# Altium schematic sheet Mainboard_RMII_Interface.SchDoc
size B
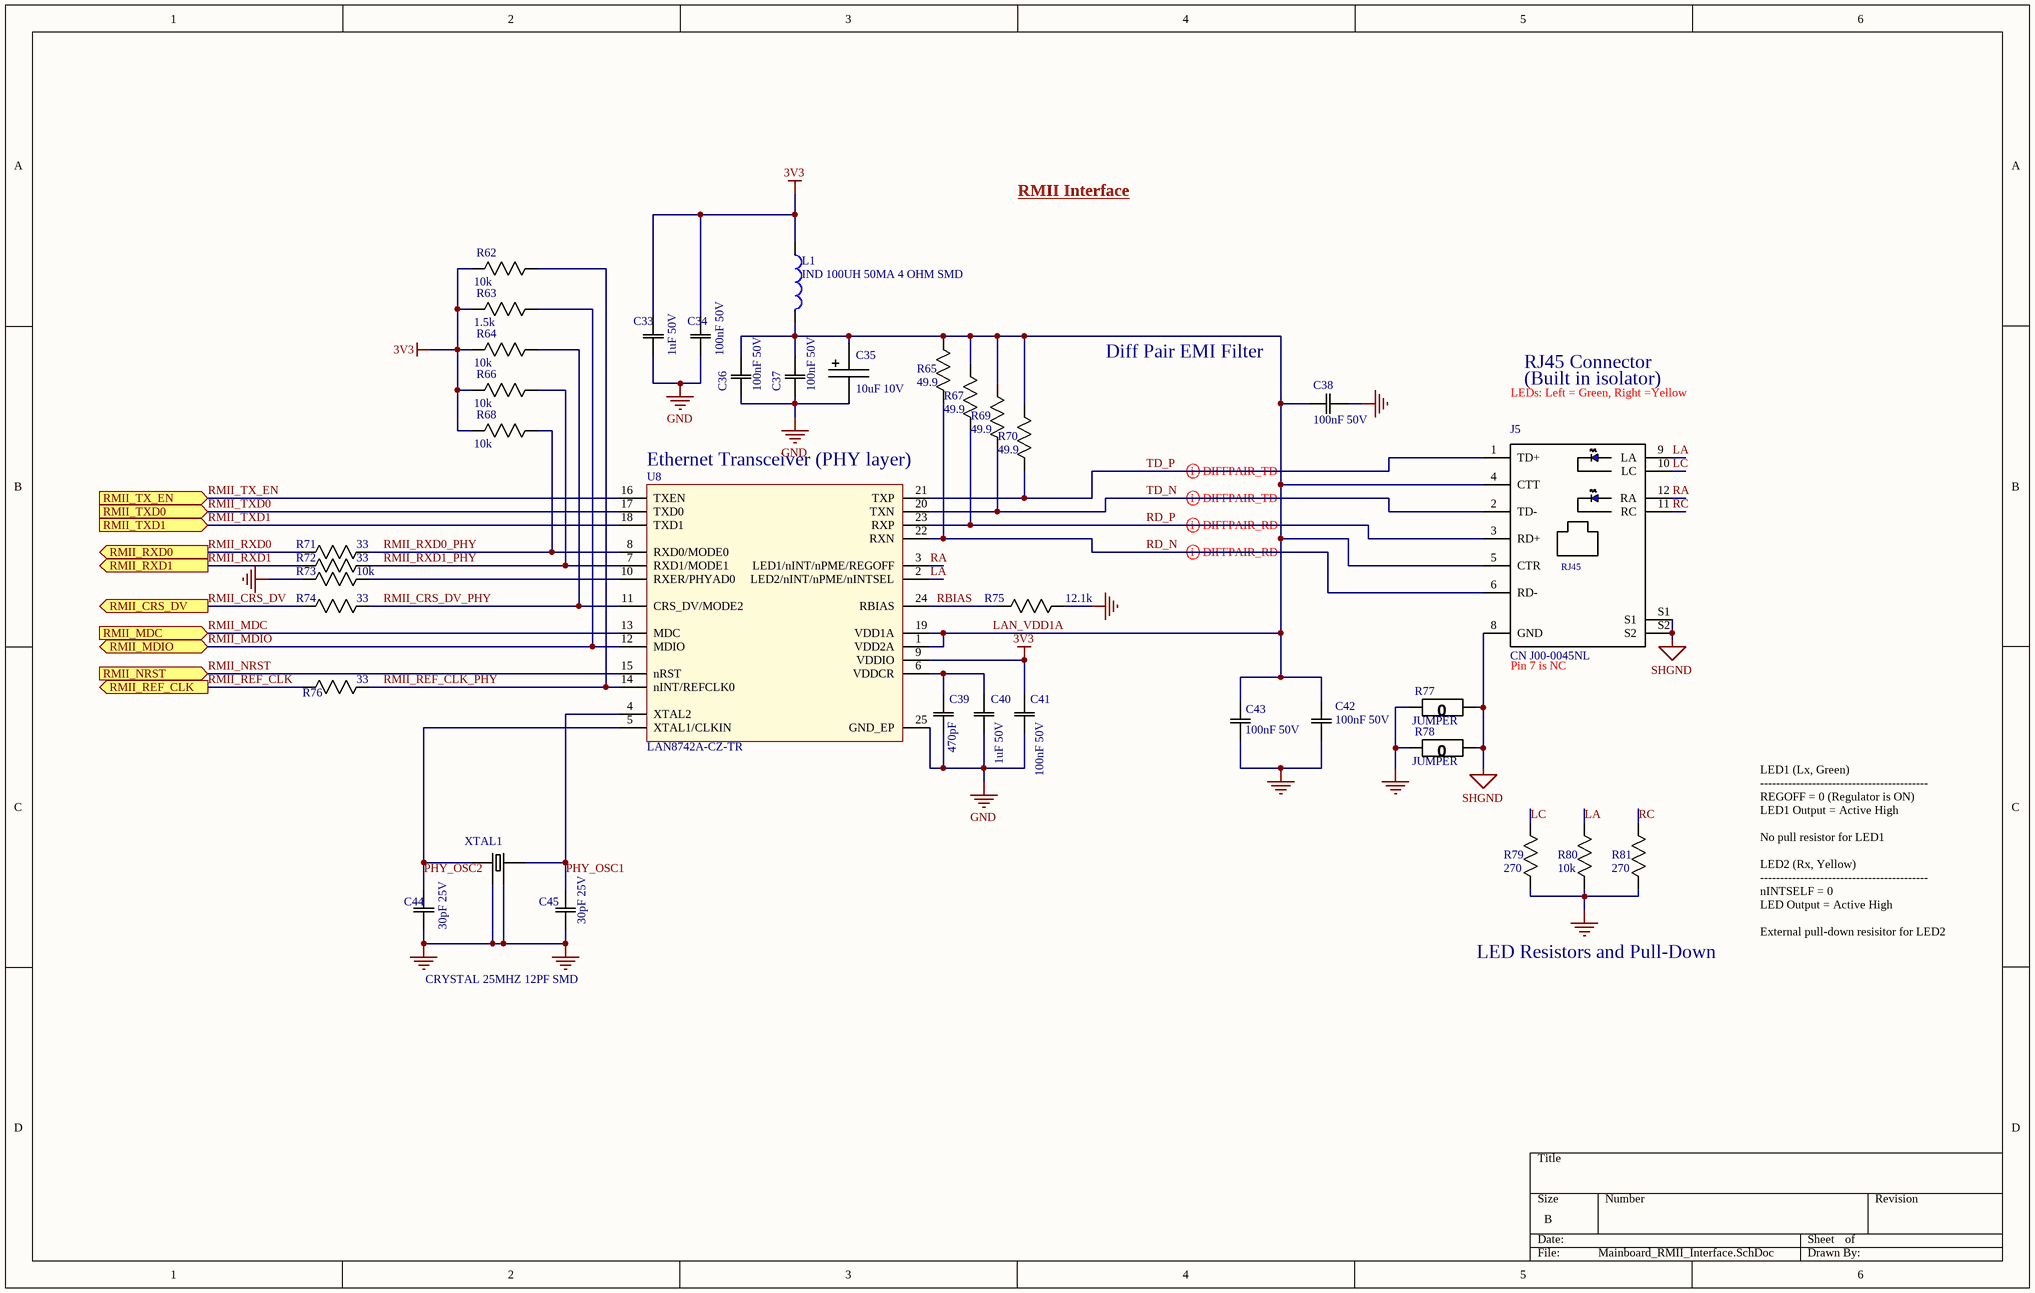
[diagram p0: Mainboard_RMII_Interface.SchDoc]

## Parts
C33  1uF 50V  [0603]
C34  100nF 50V  [0603]
C35  10uF 10V  [1206 Polarized]
C36  100nF 50V  [0603]
C37  100nF 50V  [0603]
C38  100nF 50V  [0603]
C39  470pF  [0603]
C40  1uF 50V  [0603]
C41  100nF 50V  [0603]
C42  100nF 50V  [0603]
C43  100nF 50V  [0603]
C44  30pF 25V  [0603]
C45  30pF 25V  [0603]
J5  CN J00-0045NL  [RJ45 J00-0045NL]
L1  IND 100UH 50MA 4 OHM SMD  [0805]
R62  10k  [0603]
R63  1.5k  [0603]
R64  10k  [0603]
R65  49.9  [0603]
R66  10k  [0603]
R67  49.9  [0603]
R68  10k  [0603]
R69  49.9  [0603]
R70  49.9  [0603]
R71  33  [0603]
R72  33  [0603]
R73  10k  [0603]
R74  33  [0603]
R75  12.1k  [0603]
R76  33  [0603]
R77  JUMPER  [0603]
R78  JUMPER  [0603]
R79  270  [0603]
R80  10k  [0603]
R81  270  [0603]
U8  LAN8742A-CZ-TR  [24-QFN (4x4)]
XTAL1  CRYSTAL 25MHZ 12PF SMD  [3225-4SMD]

## Ports
RMII_CRS_DV (out), RMII_MDC (in), RMII_MDIO (bidir), RMII_NRST (in), RMII_REF_CLK (out), RMII_RXD0 (out), RMII_RXD1 (out), RMII_TX_EN (in), RMII_TXD0 (in), RMII_TXD1 (in)

## Nets
3V3: C33.2(C2) C34.2(C2) C41.2(C2) L1.1 R62.2(R2) R63.2(R2) R64.2(R2) R66.2(R2) R68.2(R2) U8.9(VDDIO)
GND: C33.1(C1) C34.1(C1) C35.2(P$2) C36.1(C1) C37.1(C1) C38.2(C2) C39.1(C1) C40.1(C1) C41.1(C1) C42.1(C1) C43.1(C1) C44.1(C1) C45.1(C1) R73.2(R2) R75.1(R1) R77.2(R2) R78.2(R2) R79.2(R2) R80.2(R2) R81.2(R2) U8.25(GND_EP) XTAL1.2 XTAL1.4
SHGND: J5.8(GND) J5.S1 J5.S2 R77.1(R1) R78.1(R1)
LA: J5.9(LA) R80.1(R1) U8.2(LED2/nINT/nPME/nINTSEL)
LAN_VDD1A: C35.1(P$1) C36.2(C2) C37.2(C2) C38.1(C1) C42.2(C2) C43.2(C2) J5.4(CTT) J5.5(CTR) L1.2 R65.1(R1) R67.1(R1) R69.1(R1) R70.1(R1) U8.1(VDD2A) U8.19(VDD1A)
LC: J5.10(LC) R79.1(R1)
PHY_OSC1: C45.2(C2) U8.4(XTAL2) XTAL1.3
PHY_OSC2: C44.2(C2) U8.5(XTAL1/CLKIN) XTAL1.1
RA: J5.12(RA) U8.3(LED1/nINT/nPME/REGOFF)
RBIAS: R75.2(R2) U8.24(RBIAS)
RC: J5.11(RC) R81.1(R1)
RD_N: J5.6(RD-) R65.2(R2) U8.22(RXN)
RD_P: J5.3(RD+) R67.2(R2) U8.23(RXP)
RMII_CRS_DV: R74.2(R2) ; port RMII_CRS_DV
RMII_CRS_DV_PHY: R64.1(R1) R74.1(R1) U8.11(CRS_DV/MODE2)
RMII_MDC: U8.13(MDC) ; port RMII_MDC
RMII_MDIO: R63.1(R1) U8.12(MDIO) ; port RMII_MDIO
RMII_NRST: U8.15(nRST) ; port RMII_NRST
RMII_REF_CLK: R76.2(R2) ; port RMII_REF_CLK
RMII_REF_CLK_PHY: R62.1(R1) R76.1(R1) U8.14(nINT/REFCLK0)
RMII_RXD0: R71.2(R2) ; port RMII_RXD0
RMII_RXD0_PHY: R68.1(R1) R71.1(R1) U8.8(RXD0/MODE0)
RMII_RXD1: R72.2(R2) ; port RMII_RXD1
RMII_RXD1_PHY: R66.1(R1) R72.1(R1) U8.7(RXD1/MODE1)
RMII_TX_EN: U8.16(TXEN) ; port RMII_TX_EN
RMII_TXD0: U8.17(TXD0) ; port RMII_TXD0
RMII_TXD1: U8.18(TXD1) ; port RMII_TXD1
TD_N: J5.2(TD-) R69.2(R2) U8.20(TXN)
TD_P: J5.1(TD+) R70.2(R2) U8.21(TXP)
NetC39_2: C39.2(C2) C40.2(C2) U8.6(VDDCR)
NetR73_1: R73.1(R1) U8.10(RXER/PHYAD0)

## Layout directives
differential pair: RD_N, RD_P, TD_N, TD_P

## Notes on the sheet
- RMII Interface
- (near C38) Diff Pair EMI Filter
- RJ45 Connector
- LEDs: Left = Green, Right =Yellow
- (Built in isolator)
- Ethernet Transceiver (PHY layer)
- (near J5) Pin 7 is NC
- LED Resistors and Pull-Down
- LED1 (Lx, Green)
  ------------------------------------------
  REGOFF = 0 (Regulator is ON)
  LED1 Output = Active High
  No pull resistor for LED1
  LED2 (Rx, Yellow)
  ------------------------------------------
  nINTSELF = 0
  LED Output = Active High
  External pull-down resisitor for LED2
- (in symbol CN MAGJACK) RJ45

## Library data of the parts
C33 C40 = CAP 1uF 50V: CAP CER 1UF 50V X7R 0805; Tolerance: 10%; Package: 0805; Value: 1uF; Rating: 50V; Temperature Coefficient: X7R; Operating Temperature: -55°C ~ 125°C
C34 C36-C38 C41-C43 = CAP 100nF 50V: CAP CER 0.1UF 50V X7R 0805; Tolerance: 10%; Package: 0805; Value: 100nF; Rating: 50V
C35 = CAP TANT 10uF 10V: CAP TANT 10UF 10V 1206; Tolerance: 10%; ESR (Equivalent Series Resistance): 3.8 Ohm; Type: Molded Tantalum; Package: 1206; Value: 10uF; Rating: 10V; Operating Temperature: -55°C ~ 125°C
C39 = CAP 470pF 50V: CAP CER 470PF 50V X7R 0603/0805; Tolerance: 10%; Package: 0603/0805; Value: 470pF; Rating: 50V; Temperature Coefficient: X7R; Operating Temperature: -55°C ~ 125°C
C44 C45 = CAP 30pF 25V: CAP CER 30PF 25V NP0 0805; Tolerance: 20%; Package: 0805; Value: 30pF; Rating: 25V
J5 = CN MAGJACK: CN MAGJACK 1PORT 100 BASE-TX; MF: Pulse Electronics; Package: None; SnapEDA_Link: https://www.snapeda.com/parts/J00-0045NL/Pulse%20Electronics%20Network/view-part/87956/?ref=snap; MP: J00-0045NL; Value: *; Digikey Link: https://www.digikey.com/product-detail/en/pulse-electronics-network/J00-0045NL/553-1619-5-ND/1036860?utm_source=snapeda&utm_medium=aggregator&utm_campaign=symbol; Digikey: 553-1619-5-ND; Supplier 1: Mouser; Supplier Part Number 1: 673-J00-0045NL
L1 = IND 100UH 50MA 4 OHM SMD: 100µH Unshielded Wirewound Inductor 50mA 4Ohm 0805 (2012 Metric); MF: Taiyo Yuden; MP: LBR2012T101K; Revision: July-2002: Re-released for DXP Platform.; Value: 100uH; Digikey: 587-2048-1-ND; Digikey Link: https://www.digikey.ca/product-detail/en/taiyo-yuden/LBR2012T101K/587-2048-1-ND/1788995; Supplier 1: Digi-Key; Supplier Part Number 1: 587-4040-1-ND
R62 R64 R66 R68 R73 R80 = RES 10k 1/8W - 1%: RES SMD 10K OHM 1% 1/8W 0805; Power (Watts): 0.125W; Package: 0805; Value: 10k; Tolerance: 1%
R63 = RES 1.5k 1/8W - 1%: RES SMD 1.5K OHM 1% 1/8W 0805; Power (Watts): 0.125W; Package: 0805; Value: 1.5k; Tolerance: 1%; ComponentLink1Description: digikey; ComponentLink1URL: https://www.digikey.ca/en/products/detail/panasonic-electronic-components/ERJ-6ENF1022V/111476
R65 R67 R69 R70 = RES 49.9 1/8W: RES SMD 49.9 OHM 1% 1/8W 0805; Power (Watts): 0.125W; Package: 0805; Value: 49.9; Tolerance: 1%
R71 R72 R74 R76 = RES 33.0 1/8W - 1%: RES SMD 33 OHM 1% 1/8W 0805; Power (Watts): 0.125W; Package: 0805; Value: 33; Tolerance: 1%
R75 = RES 12.1k 1/8W: RES SMD 12.1K OHM 1% 1/8W 0805; Power (Watts): 0.125W; Package: 0805; Value: 12.1k; Tolerance: 1%
R77 R78 = RES 0 JUMPER: RES SMD 0 OHM JUMPER GENERIC 0805; Value: 0; Package: 0805
R79 R81 = RES 270.0 1/8W: RES SMD 270 OHM 5% 1/8W 0805; Power (Watts): 0.125W; Package: 0805; Value: 270; Tolerance: 5%
U8 = LAN8742A-CZ-TR: LAN8742A-CZ-TR - Small Footprint RMII 10/100 Ethernet, Transceiver with HP Auto-MDIX and flexPWR Technology SQFN-24; MF: Microchip Technology; MP: LAN8742A-CZ-TR; Digikey: LAN8742A-CZ-CT-ND; Digikey Link: https://www.digikey.ca/product-detail/en/microchip-technology/LAN8742A-CZ-TR/LAN8742A-CZ-CT-ND/8256089; Supplier 1: Digi-Key; Supplier Part Number 1: LAN8742A-CZ-CT-ND
XTAL1 = XTAL 25MHZ 12PF SMD4: 25MHz ±10ppm Crystal 12pF 40 Ohms 2-SMD, No Lead; MP: X322525MOB4SI; MF: Yangxing Tech; ESR: 70 Ohms; Package: 2-SMD, No Lead; Frequency: 25MHz; Load Capacitance: 12pF; Supplier 1: Digi-Key